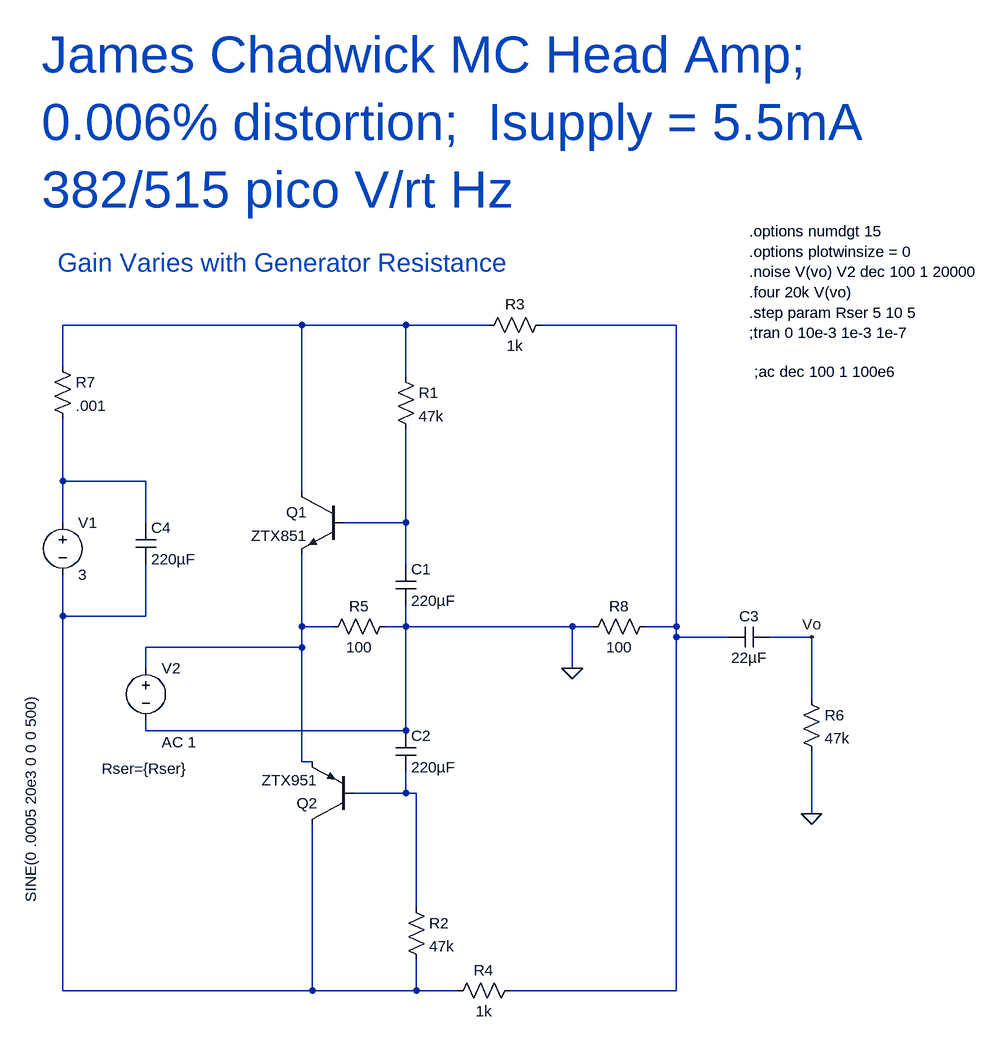
[diagram p0: schematic James Chadwick.asc]
James Chadwick.asc, the LTspice schematic file:
Version 4
SHEET 1 1924 680
WIRE -48 -560 -416 -560
WIRE 112 -560 -48 -560
WIRE 240 -560 112 -560
WIRE 528 -560 320 -560
WIRE -416 -496 -416 -560
WIRE 112 -480 112 -560
WIRE -416 -320 -416 -416
WIRE -288 -320 -416 -320
WIRE -48 -304 -48 -560
WIRE -416 -256 -416 -320
WIRE -288 -256 -288 -320
WIRE 112 -256 112 -400
WIRE 112 -256 16 -256
WIRE 112 -192 112 -256
WIRE -416 -112 -416 -176
WIRE -288 -112 -288 -192
WIRE -288 -112 -416 -112
WIRE -48 -96 -48 -208
WIRE 0 -96 -48 -96
WIRE 112 -96 112 -128
WIRE 112 -96 80 -96
WIRE 368 -96 112 -96
WIRE 400 -96 368 -96
WIRE 528 -96 528 -560
WIRE 528 -96 480 -96
WIRE 528 -80 528 -96
WIRE 608 -80 528 -80
WIRE 736 -80 672 -80
WIRE -48 -64 -48 -96
WIRE -48 -64 -288 -64
WIRE -288 -32 -288 -64
WIRE 368 -32 368 -96
WIRE 736 16 736 -80
WIRE -288 64 -288 48
WIRE 112 64 -288 64
WIRE 112 64 112 -96
WIRE -48 112 -48 -64
WIRE -32 112 -48 112
WIRE 112 160 112 128
WIRE 112 160 32 160
WIRE 128 160 112 160
WIRE 736 192 736 96
WIRE 128 336 128 160
WIRE -416 464 -416 -112
WIRE -32 464 -32 208
WIRE -32 464 -416 464
WIRE 128 464 128 416
WIRE 128 464 -32 464
WIRE 192 464 128 464
WIRE 528 464 528 -80
WIRE 528 464 272 464
FLAG 368 -32 0
FLAG 736 192 0
FLAG 736 -80 Vo
SYMBOL npn 16 -304 M0
SYMATTR InstName Q1
SYMATTR Value ZTX851
SYMBOL pnp 32 208 R180
SYMATTR InstName Q2
SYMATTR Value ZTX951
SYMBOL res 96 -496 R0
SYMATTR InstName R1
SYMATTR Value 47k
SYMBOL res 112 320 R0
SYMATTR InstName R2
SYMATTR Value 47k
SYMBOL cap 96 -192 R0
SYMATTR InstName C1
SYMATTR Value 220µF
SYMBOL cap 96 64 R0
SYMATTR InstName C2
SYMATTR Value 220µF
SYMBOL res 336 -576 R90
WINDOW 0 0 56 VBottom 2
WINDOW 3 32 56 VTop 2
SYMATTR InstName R3
SYMATTR Value 1k
SYMBOL res 288 448 R90
WINDOW 0 0 56 VBottom 2
WINDOW 3 32 56 VTop 2
SYMATTR InstName R4
SYMATTR Value 1k
SYMBOL voltage -416 -272 R0
WINDOW 123 0 0 Left 2
WINDOW 39 24 50 Left 2
SYMATTR InstName V1
SYMATTR Value 3
SYMBOL voltage -288 -48 R0
WINDOW 3 -177 376 VLeft 2
WINDOW 123 24 130 Left 2
WINDOW 39 -68 171 Left 2
SYMATTR Value SINE(0 .0005 20e3 0 0 0 500)
SYMATTR Value2 AC 1
SYMATTR SpiceLine Rser={Rser}
SYMATTR InstName V2
SYMBOL res 96 -112 R90
WINDOW 0 0 56 VBottom 2
WINDOW 3 32 56 VTop 2
SYMATTR InstName R5
SYMATTR Value 100
SYMBOL cap 672 -96 R90
WINDOW 0 0 32 VBottom 2
WINDOW 3 32 32 VTop 2
SYMATTR InstName C3
SYMATTR Value 22µF
SYMBOL res 720 0 R0
SYMATTR InstName R6
SYMATTR Value 47k
SYMBOL cap -304 -256 R0
SYMATTR InstName C4
SYMATTR Value 220µF
SYMBOL res 496 -112 R90
WINDOW 0 0 56 VBottom 2
WINDOW 3 32 56 VTop 2
SYMATTR InstName R8
SYMATTR Value 100
SYMBOL res -432 -512 R0
SYMATTR InstName R7
SYMATTR Value .001
TEXT 640 -704 Left 2 !.options numdgt 15\n.options plotwinsize = 0\n.noise V(vo) V2 dec 100 1 20000\n.four 20k V(vo)\n.step param Rser 5 10 5\n;tran 0 10e-3 1e-3 1e-7
TEXT 648 -488 Left 2 !;ac dec 100 1 100e6
TEXT -448 -976 Left 6 ;James Chadwick MC Head Amp; \n0.006% distortion;  Isupply = 5.5mA\n382/515 pico V/rt Hz
TEXT -424 -656 Left 4 ;Gain Varies with Generator Resistance

The netlist it stands for:
* James Chadwick.asc
Q1 N001 N004 N006 0 ZTX851
Q2 N005 N007 N006 0 ZTX951
R1 N001 N004 47k
R2 N007 N005 47k
C1 N004 0 220µF
C2 0 N007 220µF
R3 N002 N001 1k
R4 N002 N005 1k
V1 N003 N005 3
V2 N006 0 SINE(0 .0005 20e3 0 0 0 500) AC 1 Rser={Rser}
R5 0 N006 100
C3 Vo N002 22µF
R6 Vo 0 47k
C4 N003 N005 220µF
R8 N002 0 100
R7 N001 N003 .001
.model NPN NPN
.model PNP PNP
.lib standard.bjt
.options numdgt 15
.options plotwinsize = 0
.noise V(vo) V2 dec 100 1 20000
.four 20k V(vo)
.step param Rser 5 10 5
;tran 0 10e-3 1e-3 1e-7
;ac dec 100 1 100e6
* James Chadwick MC Head Amp;
* 0.006% distortion;  Isupply = 5.5mA
* 382/515 pico V/rt Hz
* Gain Varies with Generator Resistance
.backanno
.end